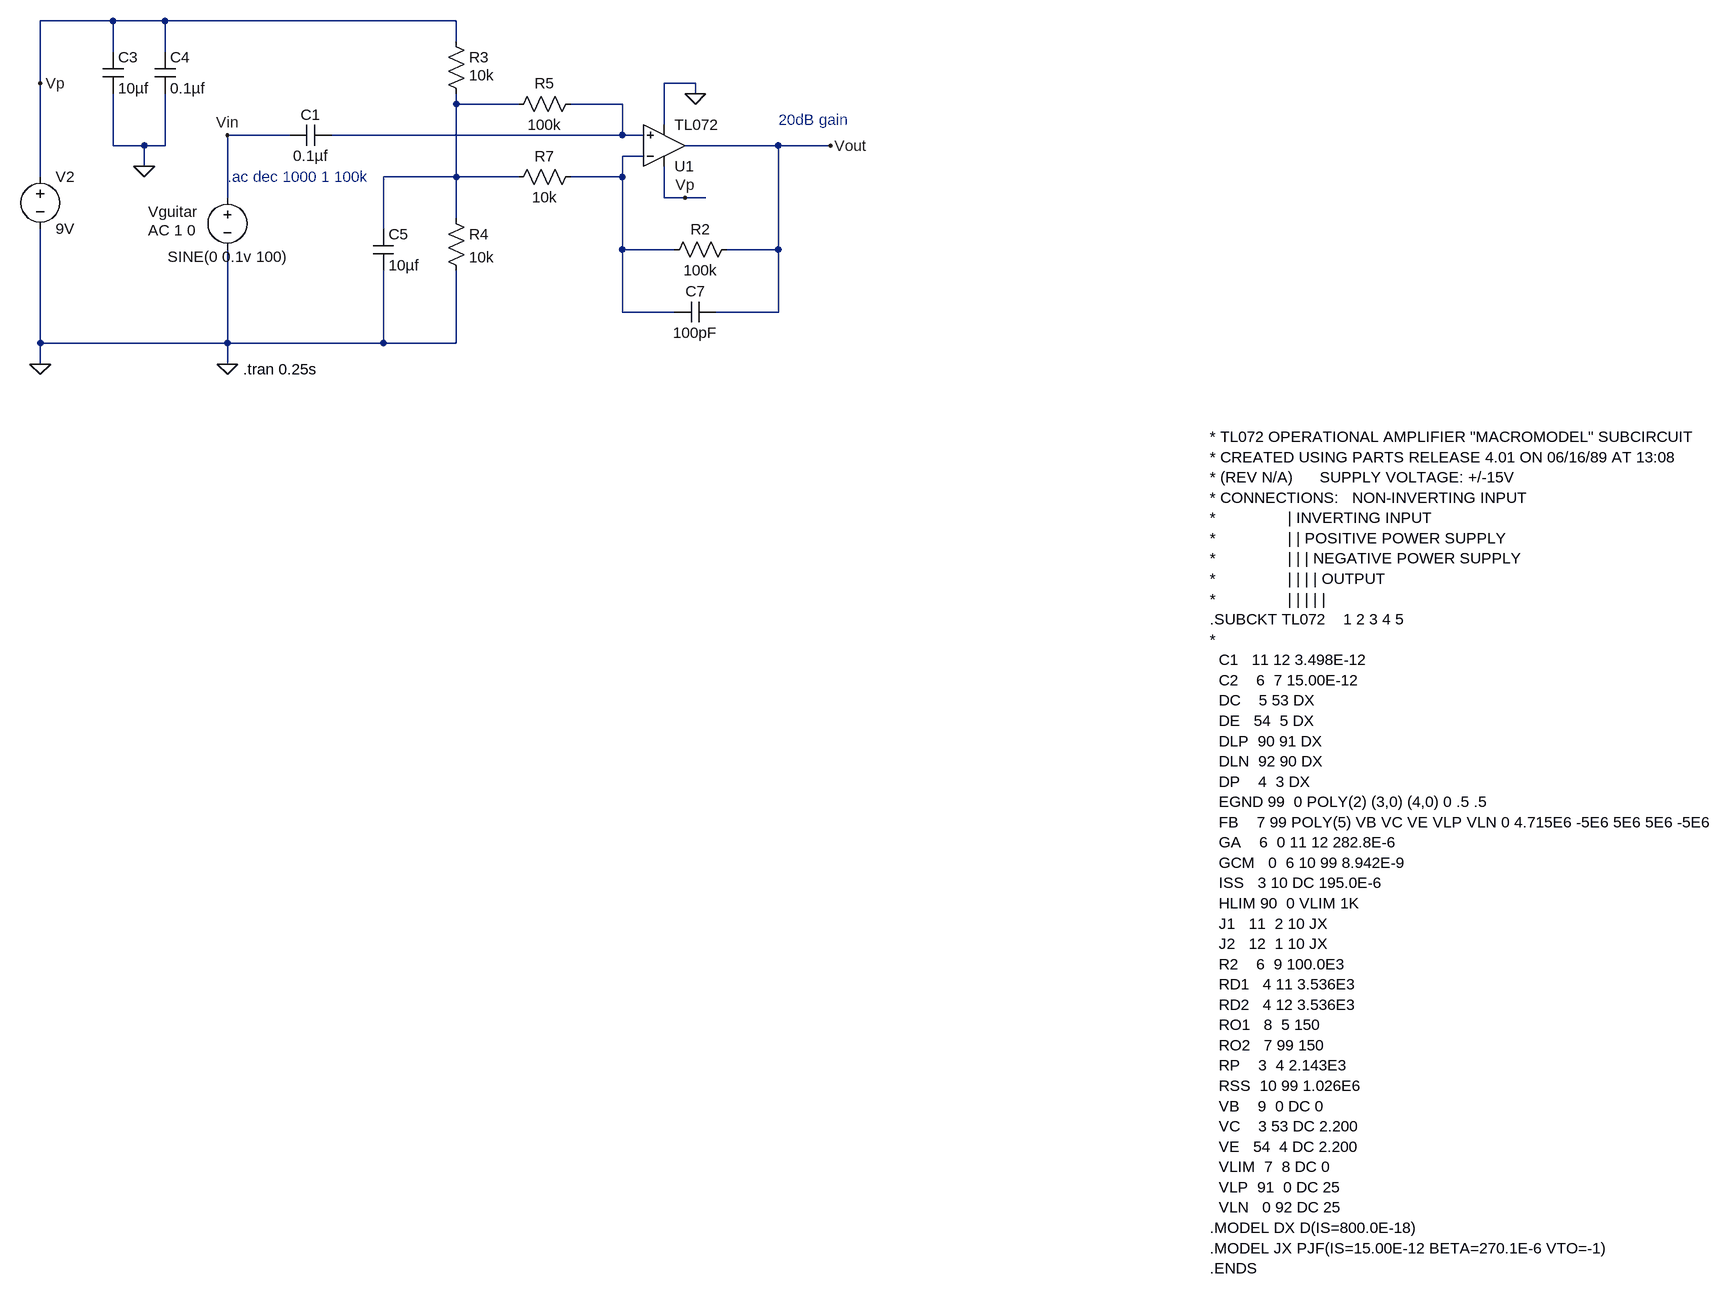
[diagram p0: schematic gain_stage_sim.asc]
gain_stage_sim.asc, the LTspice schematic file:
Version 4.1
SHEET 1 2320 1788
WIRE -784 -16 -896 -16
WIRE -704 -16 -784 -16
WIRE -256 -16 -704 -16
WIRE -256 16 -256 -16
WIRE -784 32 -784 -16
WIRE -704 32 -704 -16
WIRE -896 80 -896 -16
WIRE 112 80 64 80
WIRE 112 96 112 80
WIRE -256 112 -256 96
WIRE -160 112 -256 112
WIRE 0 112 -80 112
WIRE 64 144 64 80
WIRE -512 160 -608 160
WIRE 0 160 0 112
WIRE 0 160 -448 160
WIRE 32 160 0 160
WIRE -784 176 -784 96
WIRE -736 176 -784 176
WIRE -704 176 -704 96
WIRE -704 176 -736 176
WIRE 240 176 96 176
WIRE 320 176 240 176
WIRE 32 192 0 192
WIRE -736 208 -736 176
WIRE -896 224 -896 80
WIRE -256 224 -256 112
WIRE -256 224 -368 224
WIRE -160 224 -256 224
WIRE 0 224 0 192
WIRE 0 224 -80 224
WIRE -608 256 -608 160
WIRE 64 256 64 208
WIRE 96 256 64 256
WIRE 128 256 96 256
WIRE -256 288 -256 224
WIRE -368 304 -368 224
WIRE 0 336 0 224
WIRE 80 336 0 336
WIRE 240 336 240 176
WIRE 240 336 160 336
WIRE 0 432 0 336
WIRE 80 432 0 432
WIRE 240 432 240 336
WIRE 240 432 144 432
WIRE -896 480 -896 304
WIRE -608 480 -608 336
WIRE -608 480 -896 480
WIRE -368 480 -368 368
WIRE -368 480 -608 480
WIRE -256 480 -256 368
WIRE -256 480 -368 480
WIRE -896 512 -896 480
WIRE -608 512 -608 480
FLAG -896 80 Vp
FLAG -608 512 0
FLAG -896 512 0
FLAG 96 256 Vp
FLAG 112 96 0
FLAG -736 208 0
FLAG 320 176 Vout
FLAG -608 160 Vin
SYMBOL OpAmps\\opamp2 64 240 M180
SYMATTR InstName U1
SYMATTR Value TL072
SYMBOL res 176 320 R90
WINDOW 0 0 56 VBottom 2
WINDOW 3 32 56 VTop 2
SYMATTR InstName R2
SYMATTR Value 100k
SYMBOL voltage -608 240 R0
WINDOW 3 93 107 Right 2
WINDOW 123 -122 66 Left 2
WINDOW 39 0 0 Left 0
WINDOW 0 -122 38 Left 2
SYMATTR Value SINE(0 0.1v 100)
SYMATTR Value2 AC 1 0
SYMATTR InstName Vguitar
SYMBOL voltage -896 208 R0
SYMATTR InstName V2
SYMATTR Value 9V
SYMBOL res -272 0 R0
WINDOW 3 36 68 Left 2
SYMATTR Value 10k
SYMATTR InstName R3
SYMBOL res -272 272 R0
SYMATTR InstName R4
SYMATTR Value 10k
SYMBOL cap -800 32 R0
SYMATTR InstName C3
SYMATTR Value 10µf
SYMBOL cap -720 32 R0
SYMATTR InstName C4
SYMATTR Value 0.1µf
SYMBOL cap -448 144 R90
WINDOW 0 0 32 VBottom 2
WINDOW 3 32 32 VTop 2
SYMATTR InstName C1
SYMATTR Value 0.1µf
SYMBOL cap -384 304 R0
SYMATTR InstName C5
SYMATTR Value 10µf
SYMBOL res -64 96 R90
WINDOW 0 0 56 VBottom 2
WINDOW 3 32 56 VTop 2
SYMATTR InstName R5
SYMATTR Value 100k
SYMBOL res -64 208 R90
WINDOW 0 0 56 VBottom 2
WINDOW 3 32 56 VTop 2
SYMATTR InstName R7
SYMATTR Value 10k
SYMBOL cap 144 416 R90
WINDOW 0 0 32 VBottom 2
WINDOW 3 32 32 VTop 2
SYMATTR InstName C7
SYMATTR Value 100pF
TEXT -584 520 Left 2 !.tran 0.25s
TEXT 904 624 Left 2 !* TL072 OPERATIONAL AMPLIFIER "MACROMODEL" SUBCIRCUIT\n* CREATED USING PARTS RELEASE 4.01 ON 06/16/89 AT 13:08\n* (REV N/A)      SUPPLY VOLTAGE: +/-15V\n* CONNECTIONS:   NON-INVERTING INPUT\n*                | INVERTING INPUT\n*                | | POSITIVE POWER SUPPLY\n*                | | | NEGATIVE POWER SUPPLY\n*                | | | | OUTPUT\n*                | | | | |\n.SUBCKT TL072    1 2 3 4 5\n*\n  C1   11 12 3.498E-12\n  C2    6  7 15.00E-12\n  DC    5 53 DX\n  DE   54  5 DX\n  DLP  90 91 DX\n  DLN  92 90 DX\n  DP    4  3 DX\n  EGND 99  0 POLY(2) (3,0) (4,0) 0 .5 .5\n  FB    7 99 POLY(5) VB VC VE VLP VLN 0 4.715E6 -5E6 5E6 5E6 -5E6\n  GA    6  0 11 12 282.8E-6\n  GCM   0  6 10 99 8.942E-9\n  ISS   3 10 DC 195.0E-6\n  HLIM 90  0 VLIM 1K\n  J1   11  2 10 JX\n  J2   12  1 10 JX\n  R2    6  9 100.0E3\n  RD1   4 11 3.536E3\n  RD2   4 12 3.536E3\n  RO1   8  5 150\n  RO2   7 99 150\n  RP    3  4 2.143E3\n  RSS  10 99 1.026E6\n  VB    9  0 DC 0\n  VC    3 53 DC 2.200\n  VE   54  4 DC 2.200\n  VLIM  7  8 DC 0\n  VLP  91  0 DC 25\n  VLN   0 92 DC 25\n.MODEL DX D(IS=800.0E-18)\n.MODEL JX PJF(IS=15.00E-12 BETA=270.1E-6 VTO=-1)\n.ENDS
TEXT 240 136 Left 2 ;20dB gain
TEXT -608 224 Left 2 ;.ac dec 1000 1 100k

The netlist it stands for:
* gain_stage_sim.asc
X§U1 N002 N003 Vp 0 Vout TL072  ; pins In+ In- V+ V- OUT
R2 Vout N003 100k
Vguitar Vin 0 SINE(0 0.1v 100) AC 1 0
V2 Vp 0 9V
R3 Vp N001 10k
R4 N001 0 10k
C3 Vp 0 10µf
C4 Vp 0 0.1µf
C1 N002 Vin 0.1µf
C5 N001 0 10µf
R5 N002 N001 100k
R7 N003 N001 10k
C7 Vout N003 100pF
.tran 0.25s
* TL072 OPERATIONAL AMPLIFIER "MACROMODEL" SUBCIRCUIT
* CREATED USING PARTS RELEASE 4.01 ON 06/16/89 AT 13:08
* (REV N/A)      SUPPLY VOLTAGE: +/-15V
* CONNECTIONS:   NON-INVERTING INPUT
*                | INVERTING INPUT
*                | | POSITIVE POWER SUPPLY
*                | | | NEGATIVE POWER SUPPLY
*                | | | | OUTPUT
*                | | | | |
.SUBCKT TL072    1 2 3 4 5
*
  C1   11 12 3.498E-12
  C2    6  7 15.00E-12
  DC    5 53 DX
  DE   54  5 DX
  DLP  90 91 DX
  DLN  92 90 DX
  DP    4  3 DX
  EGND 99  0 POLY(2) (3,0) (4,0) 0 .5 .5
  FB    7 99 POLY(5) VB VC VE VLP VLN 0 4.715E6 -5E6 5E6 5E6 -5E6
  GA    6  0 11 12 282.8E-6
  GCM   0  6 10 99 8.942E-9
  ISS   3 10 DC 195.0E-6
  HLIM 90  0 VLIM 1K
  J1   11  2 10 JX
  J2   12  1 10 JX
  R2    6  9 100.0E3
  RD1   4 11 3.536E3
  RD2   4 12 3.536E3
  RO1   8  5 150
  RO2   7 99 150
  RP    3  4 2.143E3
  RSS  10 99 1.026E6
  VB    9  0 DC 0
  VC    3 53 DC 2.200
  VE   54  4 DC 2.200
  VLIM  7  8 DC 0
  VLP  91  0 DC 25
  VLN   0 92 DC 25
.MODEL DX D(IS=800.0E-18)
.MODEL JX PJF(IS=15.00E-12 BETA=270.1E-6 VTO=-1)
.ENDS
* 20dB gain
* .ac dec 1000 1 100k
.backanno
.end